# EAGLE design Clock72a (EAGLE 5.11)
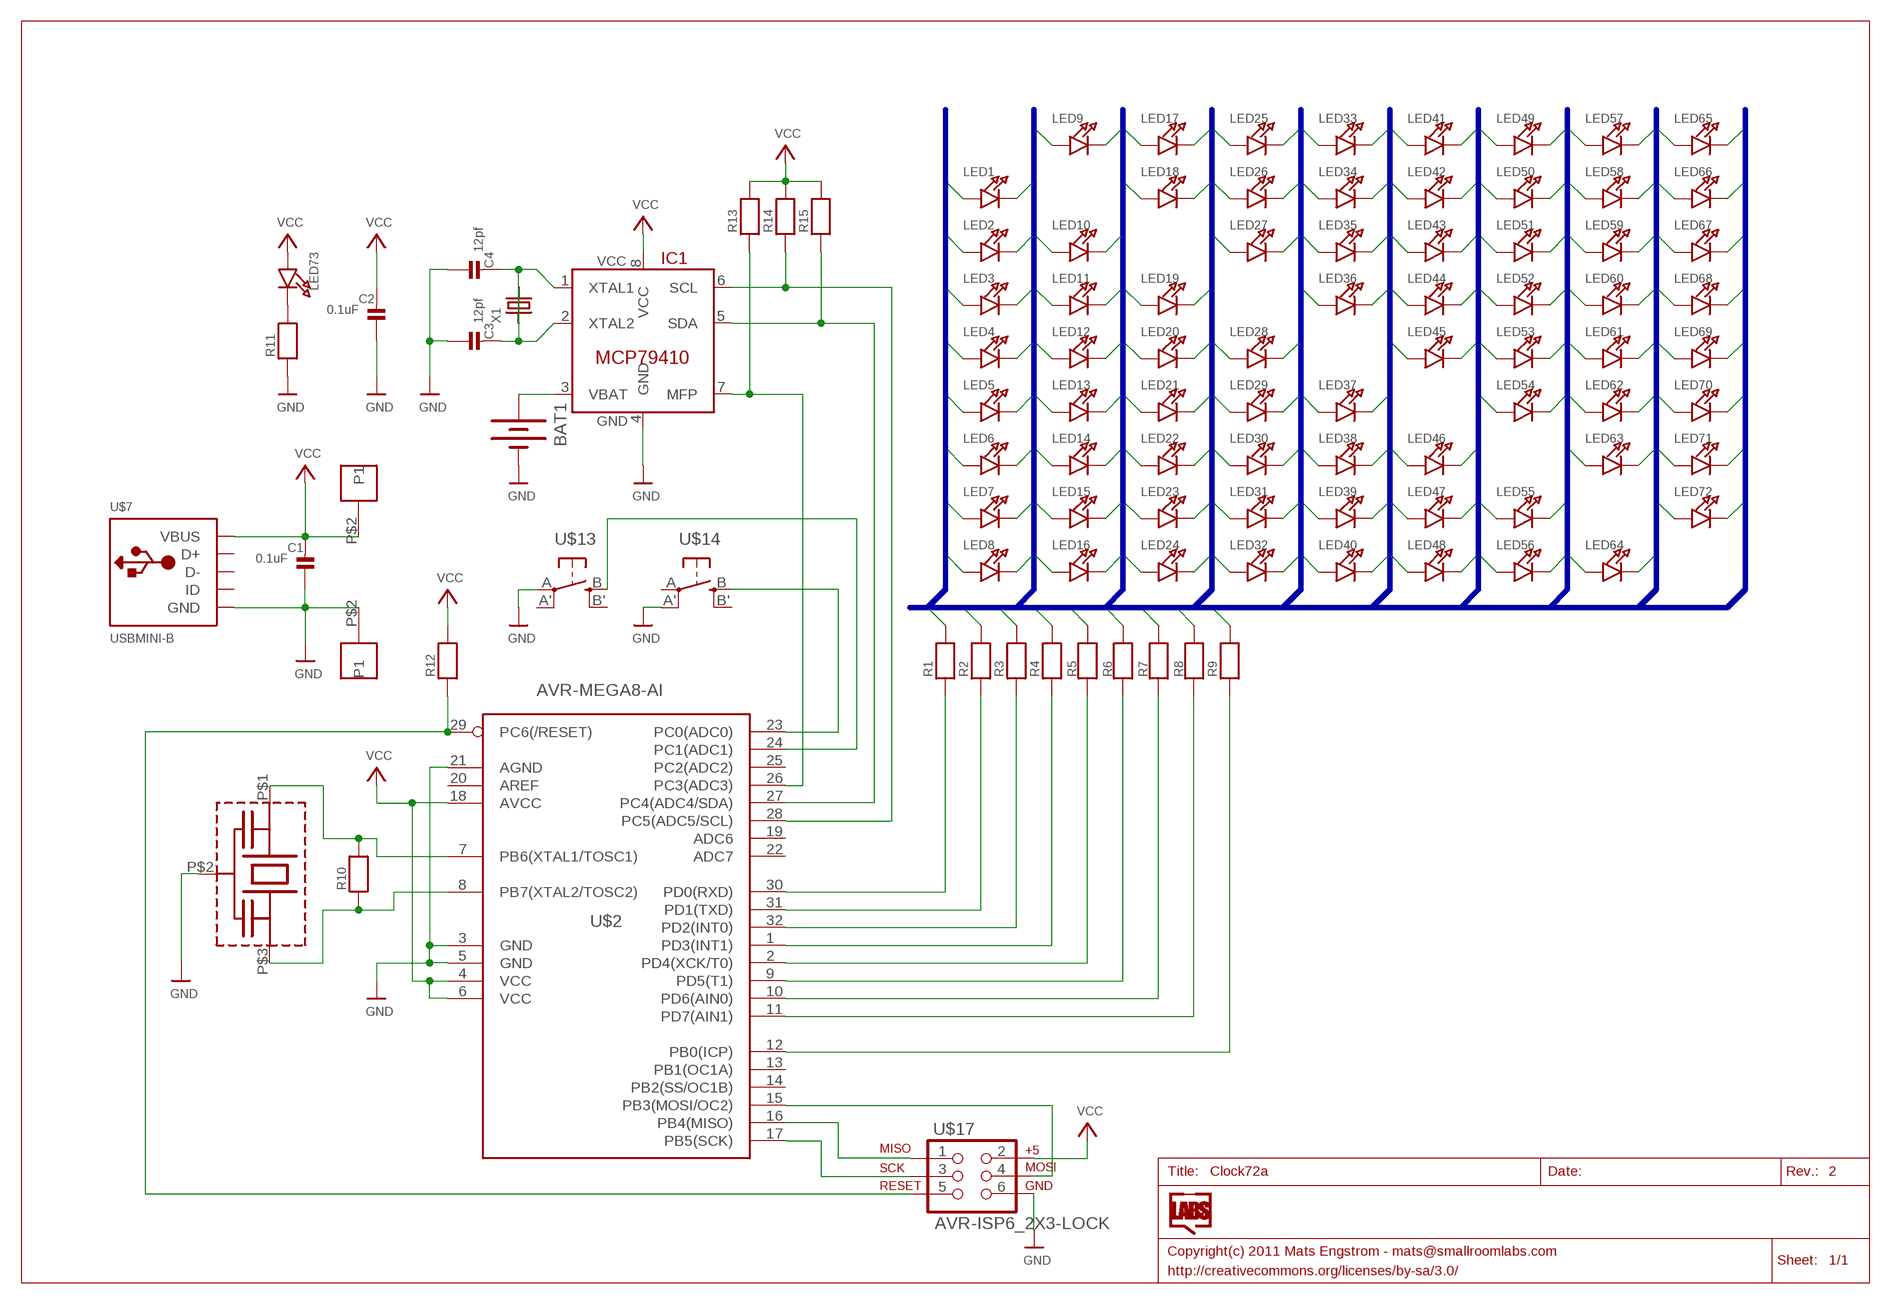
[diagram p0: schematic, sheet 1]

## Parts
BAT1  BATTERY12MM  [BATTCON_12MM]
C1  0.1uF  CAP_CERAMIC0805  [0805]
C2  0.1uF  CAP_CERAMIC0805  [0805]
C3  12pf  CAP_CERAMIC0805  [0805]
C4  12pf  CAP_CERAMIC0805  [0805]
IC1  MCP79410SOIC  MCP79410-SOIC  [SOIC8]
LED1  LEDSMD0805  [CHIPLED_0805]
LED2  LEDSMD0805  [CHIPLED_0805]
LED3  LEDSMD0805  [CHIPLED_0805]
LED4  LEDSMD0805  [CHIPLED_0805]
LED5  LEDSMD0805  [CHIPLED_0805]
LED6  LEDSMD0805  [CHIPLED_0805]
LED7  LEDSMD0805  [CHIPLED_0805]
LED8  LEDSMD0805  [CHIPLED_0805]
LED9  LEDSMD0805  [CHIPLED_0805]
LED10  LEDSMD0805  [CHIPLED_0805]
LED11  LEDSMD0805  [CHIPLED_0805]
LED12  LEDSMD0805  [CHIPLED_0805]
LED13  LEDSMD0805  [CHIPLED_0805]
LED14  LEDSMD0805  [CHIPLED_0805]
LED15  LEDSMD0805  [CHIPLED_0805]
LED16  LEDSMD0805  [CHIPLED_0805]
LED17  LEDSMD0805  [CHIPLED_0805]
LED18  LEDSMD0805  [CHIPLED_0805]
LED19  LEDSMD0805  [CHIPLED_0805]
LED20  LEDSMD0805  [CHIPLED_0805]
LED21  LEDSMD0805  [CHIPLED_0805]
LED22  LEDSMD0805  [CHIPLED_0805]
LED23  LEDSMD0805  [CHIPLED_0805]
LED24  LEDSMD0805  [CHIPLED_0805]
LED25  LEDSMD0805  [CHIPLED_0805]
LED26  LEDSMD0805  [CHIPLED_0805]
LED27  LEDSMD0805  [CHIPLED_0805]
LED28  LEDSMD0805  [CHIPLED_0805]
LED29  LEDSMD0805  [CHIPLED_0805]
LED30  LEDSMD0805  [CHIPLED_0805]
LED31  LEDSMD0805  [CHIPLED_0805]
LED32  LEDSMD0805  [CHIPLED_0805]
LED33  LEDSMD0805  [CHIPLED_0805]
LED34  LEDSMD0805  [CHIPLED_0805]
LED35  LEDSMD0805  [CHIPLED_0805]
LED36  LEDSMD0805  [CHIPLED_0805]
LED37  LEDSMD0805  [CHIPLED_0805]
LED38  LEDSMD0805  [CHIPLED_0805]
LED39  LEDSMD0805  [CHIPLED_0805]
LED40  LEDSMD0805  [CHIPLED_0805]
LED41  LEDSMD0805  [CHIPLED_0805]
LED42  LEDSMD0805  [CHIPLED_0805]
LED43  LEDSMD0805  [CHIPLED_0805]
LED44  LEDSMD0805  [CHIPLED_0805]
LED45  LEDSMD0805  [CHIPLED_0805]
LED46  LEDSMD0805  [CHIPLED_0805]
LED47  LEDSMD0805  [CHIPLED_0805]
LED48  LEDSMD0805  [CHIPLED_0805]
LED49  LEDSMD0805  [CHIPLED_0805]
LED50  LEDSMD0805  [CHIPLED_0805]
LED51  LEDSMD0805  [CHIPLED_0805]
LED52  LEDSMD0805  [CHIPLED_0805]
LED53  LEDSMD0805  [CHIPLED_0805]
LED54  LEDSMD0805  [CHIPLED_0805]
LED55  LEDSMD0805  [CHIPLED_0805]
LED56  LEDSMD0805  [CHIPLED_0805]
LED57  LEDSMD0805  [CHIPLED_0805]
LED58  LEDSMD0805  [CHIPLED_0805]
LED59  LEDSMD0805  [CHIPLED_0805]
LED60  LEDSMD0805  [CHIPLED_0805]
LED61  LEDSMD0805  [CHIPLED_0805]
LED62  LEDSMD0805  [CHIPLED_0805]
LED63  LEDSMD0805  [CHIPLED_0805]
LED64  LEDSMD0805  [CHIPLED_0805]
LED65  LEDSMD0805  [CHIPLED_0805]
LED66  LEDSMD0805  [CHIPLED_0805]
LED67  LEDSMD0805  [CHIPLED_0805]
LED68  LEDSMD0805  [CHIPLED_0805]
LED69  LEDSMD0805  [CHIPLED_0805]
LED70  LEDSMD0805  [CHIPLED_0805]
LED71  LEDSMD0805  [CHIPLED_0805]
LED72  LEDSMD0805  [CHIPLED_0805]
LED73  LEDSMD0805  [CHIPLED_0805]
R1  RESISTOR0805  [0805]
R2  RESISTOR0805  [0805]
R3  RESISTOR0805  [0805]
R4  RESISTOR0805  [0805]
R5  RESISTOR0805  [0805]
R6  RESISTOR0805  [0805]
R7  RESISTOR0805  [0805]
R8  RESISTOR0805  [0805]
R9  RESISTOR0805  [0805]
R10  RESISTOR0805  [0805]
R11  RESISTOR0805  [0805]
R12  RESISTOR0805  [0805]
R13  RESISTOR0805  [0805]
R14  RESISTOR0805  [0805]
R15  RESISTOR0805  [0805]
U$2  AVR-MEGA8-AI  [TQFP32-08]
U$7  USBMINI-B  [MOLEX67503]
U$10  PAD-2X3  [PAD2X3]
U$13  EVQQ2  [EVQ-Q2]
U$14  EVQQ2  [EVQ-Q2]
U$17  AVR-ISP6_2X3-LOCK  [2X3_LOCK]
U$21  PAD-2X3  [PAD2X3]
X1  CRYSTAL32.768  [CRYSTAL32SMT]
X2  CER-RES-3P-PBRC-H  [PBRC-H]

## Nets
CP1: LED1.C LED2.C LED3.C LED4.C LED5.C LED6.C LED7.C LED8.C LED9.A LED17.A LED25.A LED33.A LED41.A LED49.A LED57.A LED65.A R1.2
CP2: LED1.A LED9.C LED10.C LED11.C LED12.C LED13.C LED14.C LED15.C LED16.C LED18.A LED26.A LED34.A LED42.A LED50.A LED58.A LED66.A R2.2
CP3: LED2.A LED10.A LED17.C LED18.C LED19.C LED20.C LED21.C LED22.C LED23.C LED24.C LED27.A LED35.A LED43.A LED51.A LED59.A LED67.A R3.2
CP4: LED3.A LED11.A LED19.A LED25.C LED26.C LED27.C LED28.C LED29.C LED30.C LED31.C LED32.C LED36.A LED44.A LED52.A LED60.A LED68.A R4.2
CP5: LED4.A LED12.A LED20.A LED28.A LED33.C LED34.C LED35.C LED36.C LED37.C LED38.C LED39.C LED40.C LED45.A LED53.A LED61.A LED69.A R5.2
CP6: LED5.A LED13.A LED21.A LED29.A LED37.A LED41.C LED42.C LED43.C LED44.C LED45.C LED46.C LED47.C LED48.C LED54.A LED62.A LED70.A R6.2
CP7: LED6.A LED14.A LED22.A LED30.A LED38.A LED46.A LED49.C LED50.C LED51.C LED52.C LED53.C LED54.C LED55.C LED56.C LED63.A LED71.A R7.2
CP8: LED7.A LED15.A LED23.A LED31.A LED39.A LED47.A LED55.A LED57.C LED58.C LED59.C LED60.C LED61.C LED62.C LED63.C LED64.C LED72.A R8.2
CP9: LED8.A LED16.A LED24.A LED32.A LED40.A LED48.A LED56.A LED64.A LED65.C LED66.C LED67.C LED68.C LED69.C LED70.C LED71.C LED72.C R9.2
D1: R1.1 U$2.30(PD0(RXD))
D2: R2.1 U$2.31(PD1(TXD))
D3: R3.1 U$2.32(PD2(INT0))
D4: R4.1 U$2.1(PD3(INT1))
D5: R5.1 U$2.2(PD4(XCK/T0))
D6: R6.1 U$2.9(PD5(T1))
D7: R7.1 U$2.10(PD6(AIN0))
D8: R8.1 U$2.11(PD7(AIN1))
D9: R9.1 U$2.12(PB0(ICP))
GND: BAT1.GND(-) C1.1 C2.1 C3.1 C4.1 IC1.4(GND) R11.1 U$2.3(GND) U$2.5(GND) U$2.21(AGND) U$7.GND U$13.A(P) U$14.A'(P1) U$17.6(GND) U$21.P$2(P1) X2.P$2(GND)
MISO: U$2.16(PB4(MISO)) U$17.1(MISO)
MOSI: U$2.15(PB3(MOSI/OC2)) U$17.4(MOSI)
N$1: LED73.C R11.2
N$12: C4.2 IC1.1(XTAL1) X1.1
N$13: C3.2 IC1.2(XTAL2) X1.2
N$14: BAT1.PWR@1(+) IC1.3(VBAT)
N$15: IC1.5(SDA) R15.1 U$2.27(PC4(ADC4/SDA))
N$16: IC1.6(SCL) R14.1 U$2.28(PC5(ADC5/SCL))
RESET: R12.1 U$2.29(PC6(/RESET)) U$17.5(RESET)
RTCPULSE: IC1.7(MFP) R13.1 U$2.26(PC3(ADC3))
SCK: U$2.17(PB5(SCK)) U$17.3(SCK)
SW-A: U$2.23(PC0(ADC0)) U$14.B(S)
SW-B: U$2.24(PC1(ADC1)) U$13.B(S)
VCC: C1.2 C2.2 IC1.8(VCC) LED73.A R12.2 R13.2 R14.2 R15.2 U$2.4(VCC) U$2.6(VCC) U$2.18(AVCC) U$7.VBUS U$10.P$2(P1) U$17.2(V+)
XTAL1: R10.2 U$2.7(PB6(XTAL1/TOSC1)) X2.P$1(IN)
XTAL2: R10.1 U$2.8(PB7(XTAL2/TOSC2)) X2.P$3(OUT)
Unconnected: U$2.13(PB1(OC1A)) U$2.14(PB2(SS/OC1B)) U$2.19(ADC6) U$2.20(AREF) U$2.22(ADC7) U$2.25(PC2(ADC2)) U$7.D+ U$7.D- U$7.ID U$13.A'(P1) U$13.B'(S1) U$14.A(P) U$14.B'(S1)

## Buses
CP[1..9]

## Library data of the parts
BAT1 = SparkFun:BATTERY: Battery Holders Various common sizes : AA, AAA, 20mm coin cell and 12mm coin cell.
C1-C4 = microbuilder:CAP_CERAMIC: Ceramic Capacitors 0402 - 0402 Surface Mount Capacitors 0.1uF 10V 10% [Digikey: 490-1318-2-ND] 0603 - 0603 Surface Mount Capacitors 16 pF 50V 5% [Digikey: 445-5051-2-ND] 22 pF 50V [Digikey: PCC220ACVTR-ND] 33 pF 50V 5% [Digikey: 490-1415-1-ND] 56pF 50V 5% [Digikey: 490-1421-1-ND] 220pF 50V 5% [Digikey: 445-1285-1-ND] 680 pF 50V 2200 pF 50V 5% C0G [Digikey: 445-1297-1-ND] 5600 pF 100V 5% X7R [Digikey: 478-3711-1-ND] 0.1 µF 25V 10% [Digikey: PCC2277TR-ND] 0.22 µF 16V 10% X7R [Digikey: 445-1318-1-ND] 1.0 µF 25V 10% [Digikey: 445-5146-2-ND] 0603 - RF Specific 3pF 250V +/-0.1pF RF [Digikey: 712-1347-1-ND] 18 pF 250V 5% [Digikey: 478-3505-1-ND or 712-1322-1-ND] 56 pF 250V 5% C0G RF [Digikey: 490-4867-1-ND] 68 pF 250V RF [Digikey: 490-4868-1-ND] 0805 - 0805 Surface Mount Capacitors 220 pF 250V 2% RF Ceramic Capacitor [Digikey: 712-1398-1-ND] 1000 pF 50V 2% NP0 Ceramic Capacitor [Digikey: 478-3760-1-ND] 0.1 µF 25V 10% Ceramic Capacitor [Digikey: PCC1828TR-ND] 1.0 µF 16V 10% Ceramic Capacitor[Digikey: 490-1691-2-ND] 10.0 µF 10V 10% Ceramic Capacitor[Digikey: 709-1228-1-ND] 1206 - 1206 Surface Mount Capacitors
IC1 = SmallRoomLabs:MCP79410
LED1-LED73 = SmallRoomLabs:LED
R1-R15 = microbuilder:RESISTOR: Resistors 0402 - 0402 Surface Mount Package 10.0K 1% 1/16W [Digikey: 311-10.0KLRTR-ND] 0603 - 0603 Surface Mount Package 0 Ohm 1/10 Watt 1% Resistor 15 Ohm 1/10 Watt 1% Resistor 33 Ohm 1/10 Watt 1% Resistor 49.9 Ohm 1/10 Watt 1% Resistor 100 Ohm 1/10 Watt 1% Resistor 150 Ohm 1/10 Watt 1% Resistor 240 Ohm 1/10 Watt 1% Resistor 390 Ohm 1/10 Watt 1% Resistor 560 Ohm 1/10 Watt 1% Resistor 750 Ohm 1/10 Watt 1% Resistor 1.0K Ohm 1/10 Watt 1% Resistor 1.5K Ohm 1/10 Watt 1% Resistor 2.0K Ohm 1/10 Watt 1% Resistor 4.7K Ohm 1/10 Watt 1% Resistor 10.0K Ohm 1/10 Watt 1% Resistor 20.0K Ohm 1/10 Watt 1% Resistor 33.0K Ohm 1/10 Watt 1% Resistor 100.0K Ohm 1/10 Watt 1% Resistor 0805 - 0805 Surface Mount Package 0 Ohm 1/8 Watt 1% Resistor 33 Ohm 1/8 Watt 1% Resistor 100 Ohm 1/8 Watt 1% Resistor 150 Ohm 1/8 Watt 1% Resistor 200 Ohm 1/8 Watt 1% Resistor 240 Ohm 1/8 Watt 1% Resistor 330 Ohm 1/8 Watt 1% Resistor 390 Ohm 1/8 Watt 1% Resistor 470 Ohm 1/8 Watt 1% Resistor 1.0K Ohm 1/8 Watt 1% Resistor 1.5K Ohm 1/8 Watt 1% Resistor 2.0K Ohm 1/8 Watt 1% Resistor 4.7K Ohm 1/8 Watt 1% Resistor 5.1K Ohm 1/8 Watt 1% Resistor 5.6K Ohm 1/8 Watt 1% Resistor 10.0K Ohm 1/8 Watt 1% Resistor 22.0K Ohm 1/8 Watt 1% Resistor 33.0K Ohm 1/8 Watt 1% Resistor 100K Ohm 1/8 Watt 1% Resistor 1206 - 1206 Surface Mount Package
U$2 = SparkFun:AVR-MEGA8: MICROCONTROLLER 8 Kbytes FLASH 1 kbytes SRAM 512 bytes EEPROM USART 6-channel 10 bit ADC 2-channel 8 bit ADC
U$7 = SmallRoomLabs:USB
U$10 U$21 = SmallRoomLabs:PAD
U$13 U$14 = adafruit:EVQQ2: SMT 6mm switch, EVQQ2 series http://www.ladyada.net/library/eagle
U$17 = SmallRoomLabs:AVR-ISP6
X1 = microbuilder:CRYSTAL: Crystals HC49UP - Surface Mount Crystal 4.0MHz 18pF +/-30ppm Surface Mount Crystal [Digikey: 535-9857-1-ND] 12.0 MHz Surface Mount Crystal [Digikey: 535-9869-6-ND] 25.0 MHz Surface Mount Crystal [Digikey: 535-9078-1-ND] 3.2 x 2.5mm - MEMs SMT Crystal 12.0 MHz 8pF 15ppm 3.2 x 2.5mm Crystal [Digikey: 644-1047-1-ND] 16.0 MHz 8pF 15ppm 3.2 x 2.5mm Crystal [Digikey: 644-1049-1-ND] 16.0 MHz 10pF 10ppm 3.2 x 2.5mm Crystal [Digikey: 644-1100-1-ND] 27.12 MHz 18pF 30ppm 3.2 x 2.5mm Crystal [Digikey: 887-1424-1-ND] 4.9 x 1.8mm - MEMs SMT Crystal 32.768 KHz 12.5pF 20ppm 4.9 x 1.8mm Crystal [Digikey: SE2415CT-ND] Cylinder 32.768KHz Cylinder Crystal
X2 = SmallRoomLabs:CER-RES-3P

## Net classes
0 default: width 0.178 mm, drill 0.076 mm, clearance 0.178 mm

## Board
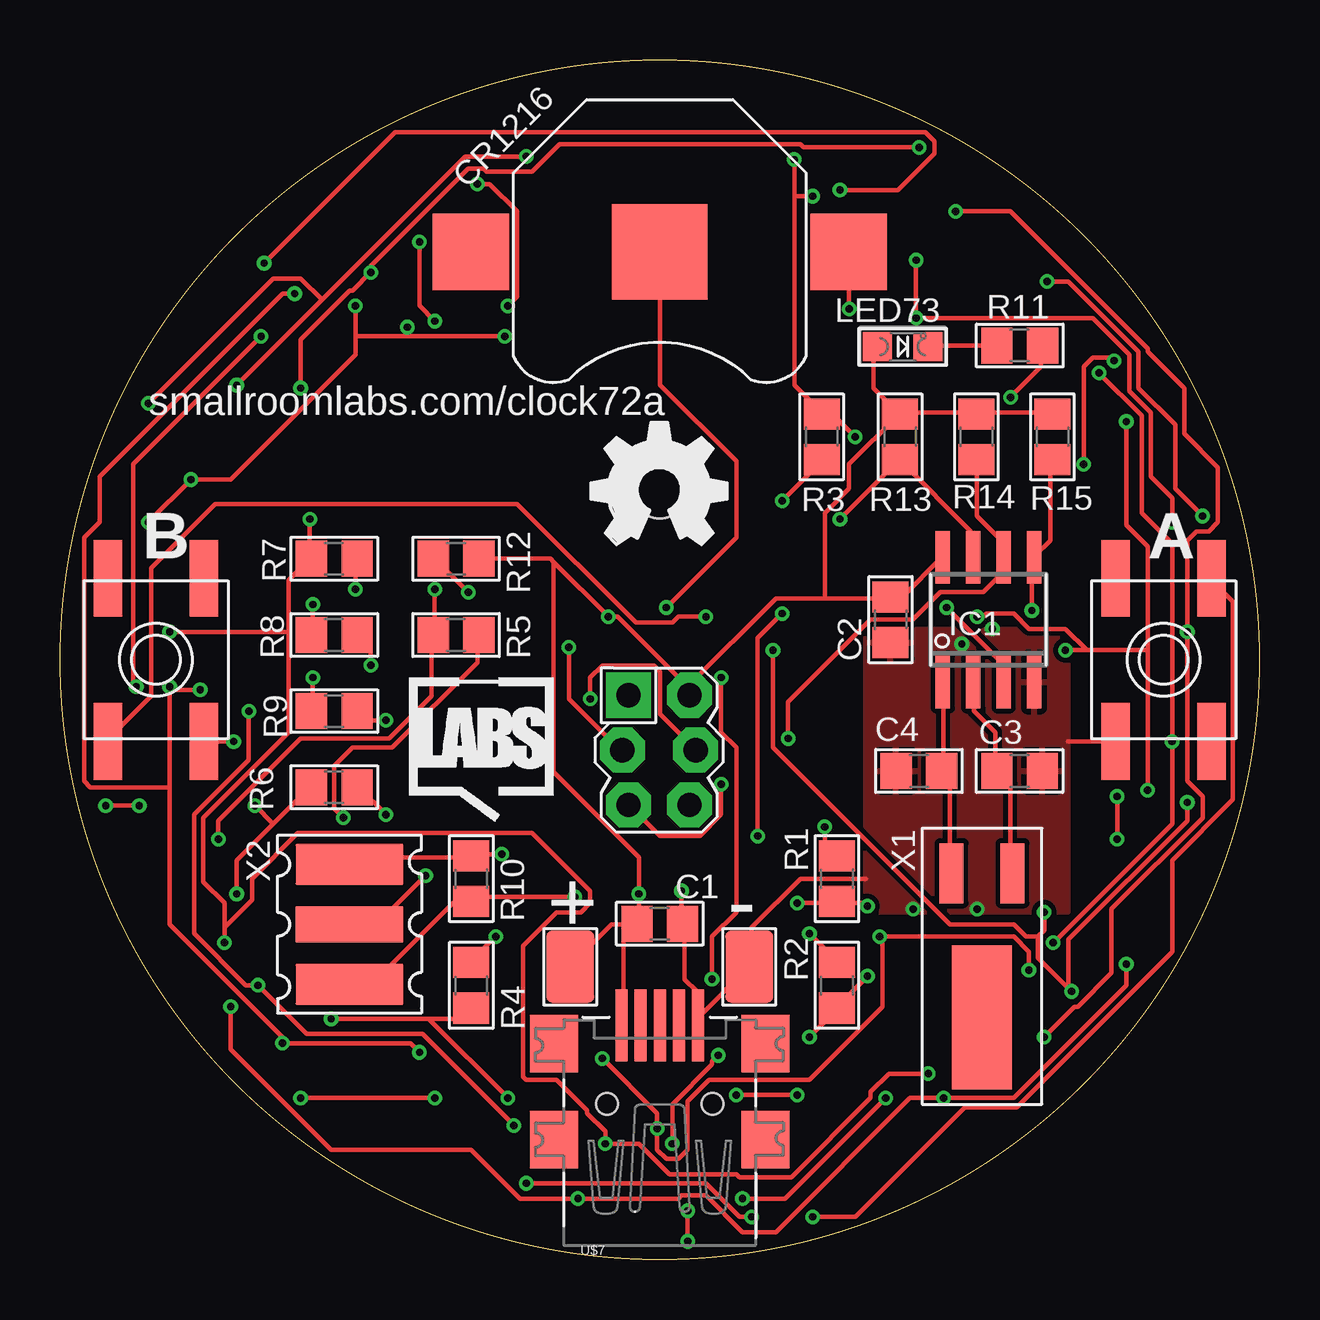
[diagram p1: board, top side]
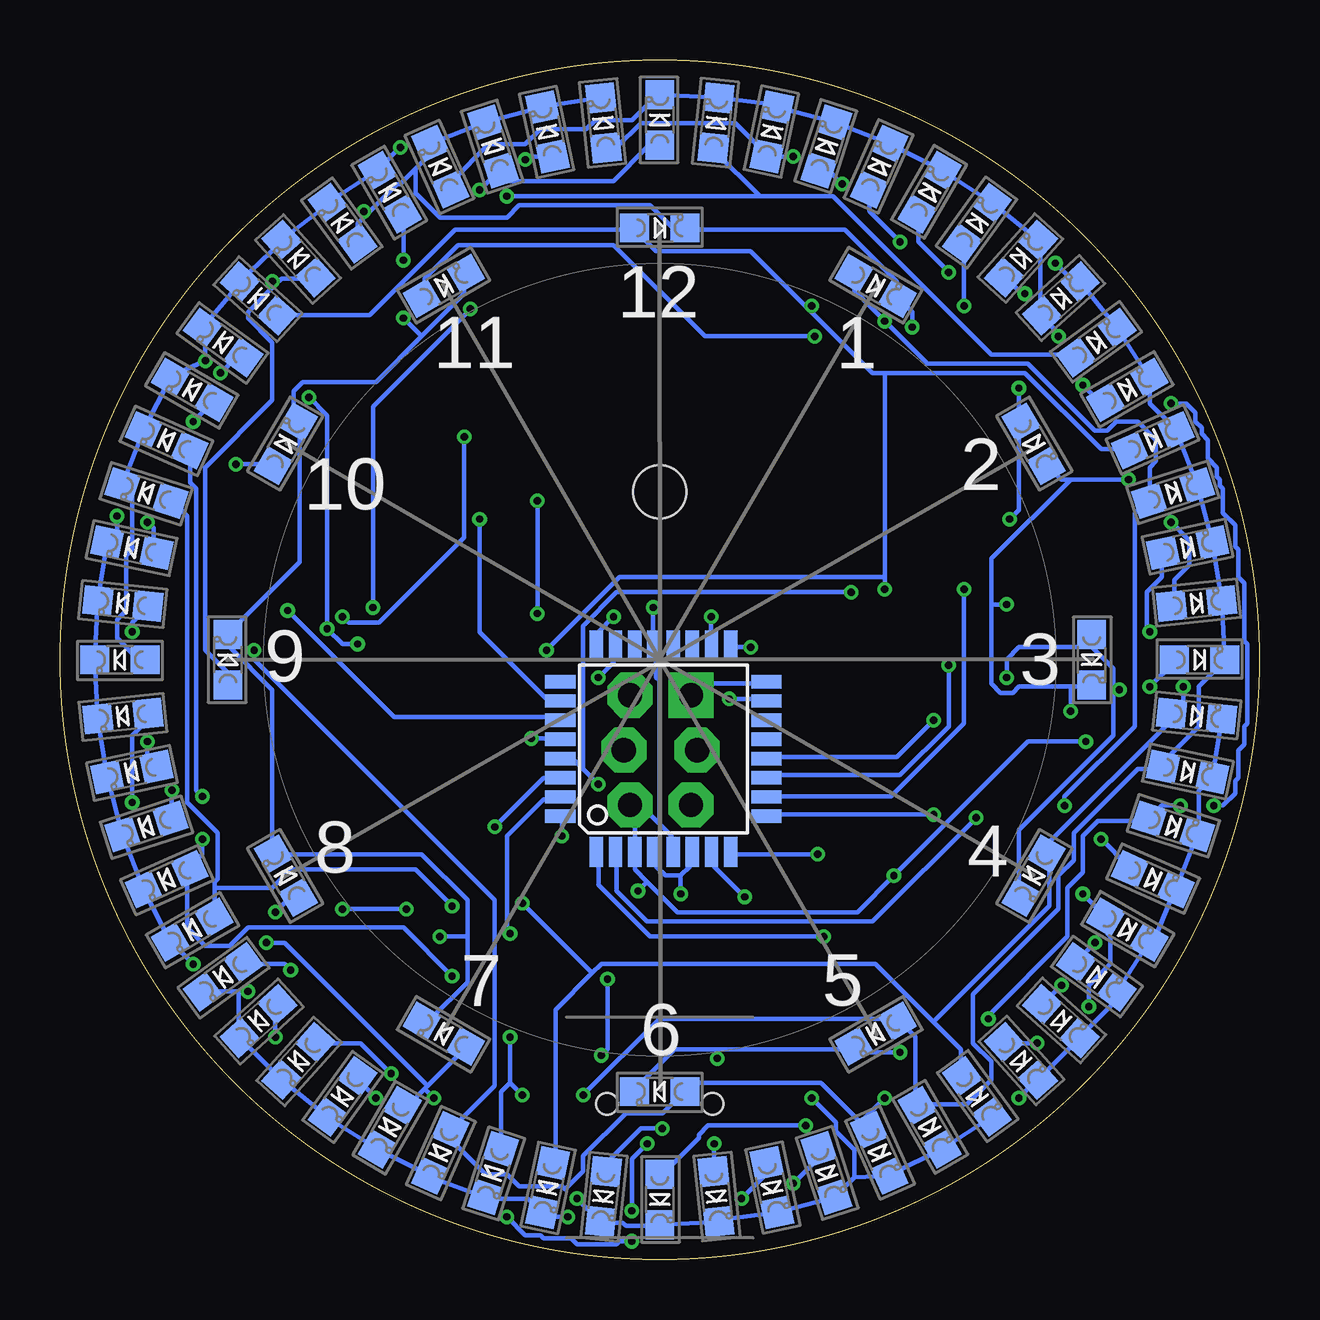
[diagram p2: board, bottom side, seen from below]

Size 50 x 50 mm. Coordinates in mm from the lower left corner, seen from the top.
Outline: circle at 25,25 radius 25
Copper layers (1*16): Top 0.035mm / dielectric 1.5mm / Bottom 0.035mm
Design rules "Fusion_eagle_rule_v1.1": minimum track width 6mil, minimum drill 12mil, track to track 6mil, track to pad 6mil, pad to pad 6mil, via to via 6mil, smd to smd 0mil, copper to edge 10mil, drill to drill 10mil, minimum pad ring 10mil, minimum via ring 6mil, stop-mask expansion 2mil, vias tented up to drill 100mil, thermal gap 10mil
Holes 2.2 mm at 25,32
tRestrict: area 22,29 to 28,35
bRestrict: area 22,29 to 28,35
vRestrict: area 19,35 to 31,48; area 65.2,33.1 to 68,35.9; area 56,17.1 to 58.9,19.9; area 65.4,12.8 to 68.2,15.7; area 61.7,10.6 to 64.5,13.4; area 72,7.1 to 74.8,10; area 75.6,31.7 to 78.4,34.5; area 63.2,26.8 to 66.1,29.6; area 61,39 to 63.8,41.8; area 64.4,40 to 67.2,42.9; area 59.6,35 to 62.5,37.8

### Footprints (pad centres in the part's own frame; a part is rotated, then mirrored left to right if it is on the bottom)
BATTCON_12MM = smd 3.962 x 3.962: GND 0,0 | smd 3.175 x 3.175: PWR@1 -7.874,0; PWR@2 7.874,0
0805 = smd 1.3 x 1.5: 1 -0.95,0; 2 0.95,0
SOIC8 = smd 0.6 x 2.2: 1 -1.905,-2.6; 2 -0.635,-2.6; 3 0.635,-2.6; 4 1.905,-2.6; 5 1.905,2.6; 6 0.635,2.6; 7 -0.635,2.6; 8 -1.905,2.6
CHIPLED_0805 = smd 1.2 x 1.2: A 0,-1.05; C 0,1.05
TQFP32-08 = smd 1.27 x 0.559: 1 -4.293,2.8; 2 -4.293,2; 3 -4.293,1.2; 4 -4.293,0.4; 5 -4.293,-0.4; 6 -4.293,-1.2; 7 -4.293,-2; 8 -4.293,-2.8; 17 4.293,-2.8; 18 4.293,-2; 19 4.293,-1.2; 20 4.293,-0.4; 21 4.293,0.4; 22 4.293,1.2; 23 4.293,2; 24 4.293,2.8 | smd 0.559 x 1.27: 9 -2.8,-4.293; 10 -2,-4.293; 11 -1.2,-4.293; 12 -0.4,-4.293; 13 0.4,-4.293; 14 1.2,-4.293; 15 2,-4.293; 16 2.8,-4.293; 25 2.8,4.293; 26 2,4.293; 27 1.2,4.293; 28 0.4,4.293; 29 -0.4,4.293; 30 -1.2,4.293; 31 -2,4.293; 32 -2.8,4.293
MOLEX67503 = smd 0.5 x 3: D+ 0,3.264; D- -0.8,3.264; GND 1.6,3.264; ID 0.8,3.264; VBUS -1.6,3.264 | smd 2 x 2.4: GND1 -4.4,-1.5; GND2 -4.4,2.5; GND3 4.4,2.5; GND4 4.4,-1.5 | hole 0.9: -2.2,0; 2.2,0
PAD2X3 = smd 2 x 3: P$2 0,0
EVQ-Q2 = smd 3.2 x 1.2: A -3.4,-2; A' 3.4,-2; B -3.4,2; B' 3.4,2
2X3_LOCK = drill 1.016 pad 1.88 square: 1 -2.286,-1.27 | drill 1.016 pad 1.88 octagon: 2 -2.286,1.27; 3 0,-1.524; 4 0,1.524; 5 2.286,-1.27; 6 2.286,1.27
CRYSTAL32SMT = smd 2.5 x 1: 1 2.125,1.27; 2 2.125,-1.27 | smd 6 x 2.5: CYLINDER -3.875,0
PBRC-H = smd 1.7 x 4.5: P$1 -2.5,0; P$3 2.5,0 | smd 1.5 x 4.5: P$2 0,0

### Placement (x,y rotation side)
BAT1  25,42 180 top
C1  25,14 180 top
C2  34.62,26.67 90 top
C3  40,20.36 180 top
C4  35.8,20.36 0 top
IC1  38.7,26.67 0 top
LED1  25,47.5 0 bottom
LED2  22.65,47.38 354 bottom
LED3  20.32,47.01 348 bottom
LED4  18.05,46.4 342 bottom
LED5  15.85,45.55 336 bottom
LED6  13.75,44.49 330 bottom
LED7  11.78,43.2 324 bottom
LED8  9.95,41.72 318 bottom
LED9  8.28,40.05 312 bottom
LED10  6.8,38.23 306 bottom
LED11  5.51,36.25 300 bottom
LED12  4.45,34.15 294 bottom
LED13  3.6,31.95 288 bottom
LED14  2.99,29.68 282 bottom
LED15  2.62,27.35 276 bottom
LED16  2.5,25 270 bottom
LED17  2.62,22.65 264 bottom
LED18  2.99,20.32 258 bottom
LED19  3.6,18.05 252 bottom
LED20  4.45,15.85 246 bottom
LED21  5.51,13.75 240 bottom
LED22  6.8,11.78 234 bottom
LED23  8.28,9.95 228 bottom
LED24  9.95,8.28 222 bottom
LED25  11.78,6.8 216 bottom
LED26  13.75,5.51 210 bottom
LED27  15.85,4.45 204 bottom
LED28  18.05,3.6 198 bottom
LED29  20.32,2.99 192 bottom
LED30  22.65,2.62 186 bottom
LED31  25,2.5 180 bottom
LED32  27.35,2.62 174 bottom
LED33  29.68,2.99 168 bottom
LED34  31.95,3.6 162 bottom
LED35  34.15,4.45 156 bottom
LED36  36.25,5.51 150 bottom
LED37  38.23,6.8 144 bottom
LED38  40.05,8.28 138 bottom
LED39  41.72,9.95 132 bottom
LED40  43.2,11.78 126 bottom
LED41  44.49,13.75 120 bottom
LED42  45.55,15.85 114 bottom
LED43  46.4,18.05 108 bottom
LED44  47.01,20.32 102 bottom
LED45  47.38,22.65 96 bottom
LED46  47.5,25 90 bottom
LED47  47.38,27.35 84 bottom
LED48  47.01,29.68 78 bottom
LED49  46.4,31.95 72 bottom
LED50  45.55,34.15 66 bottom
LED51  44.49,36.25 60 bottom
LED52  43.2,38.23 54 bottom
LED53  41.72,40.05 48 bottom
LED54  40.05,41.72 42 bottom
LED55  38.23,43.2 36 bottom
LED56  36.25,44.49 30 bottom
LED57  34.15,45.55 24 bottom
LED58  31.95,46.4 18 bottom
LED59  29.68,47.01 12 bottom
LED60  27.35,47.38 6 bottom
LED61  25,43 270 bottom
LED62  16,40.59 240 bottom
LED63  9.41,34 210 bottom
LED64  7,25 180 bottom
LED65  9.41,16 150 bottom
LED66  16,9.41 120 bottom
LED67  25,7 90 bottom
LED68  34,9.41 60 bottom
LED69  40.59,16 30 bottom
LED70  43,25 0 bottom
LED71  40.59,34 330 bottom
LED72  34,40.59 300 bottom
LED73  35.13,38.05 270 top
R1  32.38,15.88 270 top
R2  32.38,11.43 270 top
R3  31.75,34.29 90 top
R4  17.14,11.43 270 top
R5  16.51,26.04 180 top
R6  11.43,19.68 180 top
R7  11.43,29.21 180 top
R8  11.43,26.04 180 top
R9  11.43,22.86 180 top
R10  17.14,15.88 270 top
R11  40.01,38.1 180 top
R12  16.51,29.21 0 top
R13  35.02,34.29 90 top
R14  38.2,34.29 90 top
R15  41.37,34.29 90 top
U$2  24.84,21.28 90 bottom
U$7  25,6.5 0 top
U$10  21.27,12.2 0 top
U$13  4,25 90 top
U$14  46,25 270 top
U$17  24.97,21.23 270 top
U$19  [OSHW_FILLX200_NOTEXT]  22.14,29.8 0 top
U$20  [SRL-LOGO-SILK-5MM]  14.52,19.32 0 top
U$21  28.73,12.2 0 top
X1  38.43,13.97 90 top
X2  12.06,13.97 90 top

### Tracks (layer width: path | path; a pad name or v marks a point on that pad's centre or on a via)
CP1  (via drill 0.3)
  Top 0.178: v30.73,14.86 32.38,14.86 | 32.38,14.86 R1.2 32.38,14.86 | v33.66,14.73 33.53,14.86 32.38,14.86 | v8.38,38.48 3.05,33.15 3.05,24 v3.17,23.88
  Bottom 0.178: LED57.A 33.66,44.7 33.66,44.96 32.13,46.48 30.61,46.48 29.97,47.12 28.07,47.12 27.69,47.5 26.16,47.5 25.02,48.64 LED1.C LED2.C | LED2.C 22.48,48.39 | 43.56,15.49 43.56,15.75 43.43,15.88 43.43,17.78 44.7,19.05 44.7,30.99 45.34,31.62 LED49.A | 43.56,15.49 43.56,14.35 LED41.A | 27.81,11.94 27.43,12.32 16,12.32 13.59,9.91 | 27.81,11.94 29.34,10.41 29.34,4.06 LED33.A | 13.59,9.91 12.45,8.76 12.45,7.75 LED25.A | 13.59,9.91 8.76,14.73 8.76,16.89 LED65.A 8.76,17.02 8.76,17.4 3.68,22.48 3.68,22.73 LED17.A 3.56,22.86 3.17,23.24 v3.17,23.88 | 27.81,11.94 v30.73,14.86 | 43.56,15.49 41.15,15.49 40.39,16.26 35.18,16.26 v33.66,14.73 | v8.38,38.48 8.38,38.61 9.02,39.24 LED9.A 9.14,39.37 9.14,42.42 LED8.C LED7.C LED6.C LED5.C LED4.C LED3.C 20.19,48.13 LED2.C
CP2  (via drill 0.3)
  Top 0.178: v31.24,9.27 32.38,10.41 R2.2 32.38,10.54 v33.66,11.81 | v44.07,17.53 v44.07,19.3 | v32.51,44.58 34.92,44.58 36.45,46.1 36.45,46.61 36.07,46.99 13.97,46.99 v8.51,41.53 | v28.19,6.86 v30.73,6.86
  Bottom 0.178: 31.24,7.37 31.62,6.99 31.62,4.7 LED34.A | 31.24,7.37 v31.24,9.27 | v33.66,11.81 35.69,13.84 42.16,13.84 42.93,13.08 43.94,13.08 44.7,13.84 44.7,16.26 LED42.A 44.58,16.38 44.07,16.89 v44.07,17.53 | v44.07,19.3 44.32,19.56 44.32,32.13 44.58,32.38 44.58,33.66 LED50.A | LED1.A 25.02,46.35 25.53,46.35 26.92,44.96 31.24,44.96 31.62,45.34 LED58.A 31.75,45.34 v32.51,44.58 | v8.51,41.53 7.62,40.64 LED9.C LED10.C LED11.C 4.57,36.7 4.57,35.69 3.56,34.67 LED12.C LED13.C LED14.C LED15.C LED16.C 1.52,24.89 2.54,23.88 2.54,22.23 3.94,20.83 3.94,20.57 LED18.A 4.06,20.45 5.08,20.45 7.75,17.78 7.75,16.64 8.38,16 8.38,14.61 11.94,11.05 11.94,9.02 11.18,8.26 11.18,7.49 12.19,6.48 14.22,6.48 LED26.A 14.35,6.48 14.35,9.27 14.99,9.91 LED66.A 15.11,10.03 25.02,10.03 v28.19,6.86 | v30.73,6.86 31.24,7.37
CP3  (via drill 0.3)
  Top 0.178: 30.61,44.32 30.61,36.45 31.75,35.31 R3.2 31.75,35.18 32.26,35.18 v33.15,34.29 | 30.61,44.32 v30.61,45.85 | 30.61,44.32 v31.37,44.32 | v44.45,34.92 44.45,30.61 45.34,29.72 45.34,25.4 | 45.34,25.4 v45.34,19.56 | v41.91,25.4 42.8,25.4 | 42.8,25.4 45.34,25.4 | v10.03,6.73 v15.62,6.73 | v38.23,26.8 38.48,26.8 38.61,26.92 39.75,26.92 40.39,26.29 41.91,26.29 42.8,25.4
  Bottom 0.178: v30.61,45.85 30.48,45.97 LED59.A | 20.83,44.32 17.78,44.32 11.18,37.72 7.75,37.72 LED10.A | 20.83,44.32 22.73,46.23 LED2.A | v31.37,44.32 20.83,44.32 | v44.45,34.92 43.69,35.69 LED51.A | v45.34,19.56 45.34,18.41 LED43.A | 16.64,5.71 18.29,7.37 23.62,7.37 23.88,7.11 LED67.A 24,6.99 24.89,6.1 26.42,6.1 28.19,4.32 28.19,3.68 28.96,2.92 29.08,3.05 30.86,3.05 31.37,3.56 32.26,3.56 33.66,4.95 33.66,5.33 LED35.A 33.66,5.46 31.88,7.24 31.88,14.99 41.91,25.02 v41.91,25.4 | 16.64,5.71 16.38,5.46 LED27.A 16.64,5.71 | v10.03,6.73 9.27,7.49 LED24.C LED23.C 7.49,9.27 5.97,10.79 5.97,11.05 LED22.C LED21.C 4.65,12.68 3.56,15.37 LED20.C LED19.C 2.54,17.78 2.54,19.56 2.03,20.07 LED18.C LED17.C | v15.62,6.73 16.64,5.71 | v33.15,34.29 33.15,30.1 36.7,26.54 37.97,26.54 v38.23,26.8
CP4  (via drill 0.3)
  Top 0.178: v43.31,36.96 45.09,35.18 45.09,31.11 46.35,29.84 v46.35,21.59 46.35,18.16 v41.4,13.21 | 10.92,40.01 16.89,45.97 v19.43,45.97 | 10.92,40.01 v7.37,36.45 | 15.37,10.03 16.76,10.03 17.14,10.41 R4.2 | 15.37,10.03 v11.3,10.03 | v18.67,6.73 15.37,10.03 | 10.92,40.01 10.03,40.89 8.89,40.89 v3.68,35.69 | v3.3,18.92 v1.91,18.92 | v34.42,6.73 30.23,2.54 v28.45,2.54
  Bottom 0.178: 34.67,7.24 33.15,8.76 LED68.A | 34.8,7.11 34.67,7.24 | 34.8,7.11 35.43,6.48 35.69,6.48 LED36.A | v43.31,36.96 42.67,37.59 42.42,37.59 LED52.A | v46.35,21.59 46.35,20.83 46.1,20.57 LED44.A | 34.67,7.24 40.64,13.21 v41.4,13.21 | v7.37,36.45 6.73,35.81 6.48,35.81 LED11.A | v19.43,45.97 20.45,45.97 LED3.A 20.57,46.1 21.84,47.37 25.78,47.37 26.8,46.35 27.18,46.35 LED60.A | LED29.C 20.19,1.91 | LED27.C 15.49,3.43 | LED26.C 13.34,4.57 | LED27.C 15.37,3.56 LED26.C | 11.18,5.84 LED25.C LED26.C | v11.3,10.03 11.3,10.16 8,13.46 8,15.49 7.37,16.13 7.37,17.65 6.73,18.29 4.7,18.29 LED19.A 4.57,18.41 4.06,18.92 v3.3,18.92 | 16.89,3.43 16.89,4.57 17.65,5.33 17.65,5.71 v18.67,6.73 | v3.68,35.69 3.05,35.69 2.67,35.31 2.67,34.92 2.41,34.67 2.41,34.42 2.16,34.16 2.16,33.4 1.78,33.02 1.78,32.64 1.65,32.51 1.65,32.26 1.52,32.13 1.52,31.11 1.02,30.61 1.02,29.72 0.89,29.59 0.89,28.45 0.64,28.19 0.64,25.78 0.51,25.65 0.51,22.35 0.64,22.23 0.64,21.46 0.89,21.21 0.89,20.07 1.02,19.94 1.02,19.43 1.52,18.92 v1.91,18.92 | v34.42,6.73 34.8,7.11 | v28.45,2.54 27.56,1.65 LED32.C 27.43,1.52 26.54,1.52 26.42,1.4 25.02,1.4 LED31.C LED30.C 22.48,1.65 LED29.C | LED29.C LED28.C 17.65,2.67 16.89,3.43 | LED27.C 16.89,3.43
CP5  (via drill 0.3)
  Top 0.178: v41.02,14.48 41.02,13.72 40.77,13.46 | 40.77,13.46 40.77,12.57 42.04,11.3 | 42.04,11.3 v42.16,11.18 42.04,11.3 | v46.99,19.05 46.99,18.29 42.04,13.34 42.04,11.3 | v19.43,3.17 26.92,3.17 28.32,1.78 v28.83,1.78 | v6.6,17.53 6.6,18.29 10.03,21.72 13.72,21.72 15.49,23.5 15.49,26.04 R5.2 15.62,26.04 v15.62,27.94 | v17.4,44.83 17.91,44.83 19.05,43.69 19.05,40.13 v18.67,39.75 | 40.77,13.46 40.26,13.46 39.75,13.97 37.08,13.97 29.72,21.34 v29.72,25.4
  Bottom 0.178: v41.02,14.48 40.51,14.99 40.13,14.99 LED69.A | 42.55,11.18 43.94,11.18 LED40.C | 42.55,11.18 v42.16,11.18 | v46.99,19.05 46.99,21.84 46.35,22.48 46.35,22.73 LED45.A | 42.55,11.18 42.55,9.27 LED39.C LED38.C LED37.C 38.73,5.84 LED36.C | LED36.C 36.83,4.7 | v19.43,3.17 18.41,4.19 18.41,4.57 LED28.A | v28.83,1.78 29.72,1.78 29.84,1.91 LED33.C 29.97,2.03 30.48,2.54 32.26,2.54 LED34.C | LED34.C 32.38,2.67 | v6.6,17.53 5.46,16.38 LED20.A | 15.62,36.96 16.13,36.96 18.8,39.62 | 15.62,36.96 9.78,36.96 6.6,33.78 5.46,33.78 LED12.A | 18.8,39.62 21.21,42.04 25.15,42.04 26.04,42.93 LED61.A 26.16,42.93 33.53,42.93 37.08,39.37 40.89,39.37 LED53.A | v17.4,44.83 17.91,45.34 18.29,45.34 LED4.A | 18.8,39.62 v18.67,39.75 | 15.62,28.45 15.62,36.96 | 15.62,28.45 v15.62,27.94 | v29.72,25.4 26.67,28.45 15.62,28.45 | LED36.C LED35.C 34.54,3.43 LED34.C
CP6  (via drill 0.3)
  Top 0.178: v7.37,15.24 7.37,16.64 8.89,18.16 | 8.89,18.16 10.41,19.68 R6.2 | v14.99,42.42 14.99,39.75 v15.62,39.12 | 8.89,18.16 v8.13,18.92 | v44.45,12.32 44.45,11.43 39.75,6.73 v36.83,6.73 35.43,6.73 29.84,1.14 28.45,1.14 26.92,2.67 25.91,2.67 25.78,2.54 v21.59,2.54 19.18,2.54 17.14,4.57 11.3,4.57 7.11,8.76 v7.11,10.54 | v41.15,40.77 42.04,40.77 44.96,37.85 44.96,36.32 46.48,34.8 46.48,32.13 v47.62,30.99
  Bottom 0.178: v7.37,15.24 6.48,14.35 LED21.A 6.35,14.22 6.35,13.59 6.22,13.46 6.22,12.32 7.11,11.43 v7.11,10.54 | LED62.A 16.89,41.02 16.89,40.39 v15.62,39.12 13.84,37.34 9.65,37.34 6.86,34.54 6.35,34.54 5.97,34.92 5.08,34.92 4.32,34.16 4.32,33.27 4.57,33.02 4.57,31.75 LED13.A 4.7,31.62 5.21,31.11 5.21,22.23 8.13,19.3 v8.13,18.92 | v14.99,42.42 16.26,43.69 16.26,44.58 LED5.A | 41.02,40.64 40.77,40.89 39.37,40.89 LED54.A | 41.02,40.64 42.16,39.5 42.16,39.24 41.15,38.23 41.15,35.81 43.94,33.02 43.94,25.4 43.05,24.51 43.05,24 LED70.A | LED41.C 45.47,13.34 | LED45.C 48.51,22.61 | LED43.C 47.5,17.78 | v21.59,2.54 20.57,3.56 20.57,3.94 LED29.A | v36.83,6.73 37.72,7.62 LED37.A | v44.45,12.32 45.34,13.21 LED41.C | v41.15,40.77 41.02,40.64 | v47.62,30.99 47.62,30.35 48.01,29.97 LED48.C LED47.C LED46.C LED45.C | LED45.C LED44.C 48.01,20.07 LED43.C | LED43.C LED42.C 46.48,15.37 LED41.C
CP7  (via drill 0.3)
  Top 0.178: v42.67,33.15 42.67,37.21 43.05,37.59 43.81,37.59 v43.94,37.47 | v36.2,7.75 34.54,7.75 33.78,6.99 33.78,6.73 30.48,3.43 28.32,3.43 28.19,3.56 25.4,3.56 24.13,4.83 v22.73,4.83 22.73,5.33 21.97,6.1 21.97,6.22 20.7,7.49 19.43,7.49 19.3,7.62 19.3,13.08 20.7,14.48 21.72,14.48 22.1,14.86 22.1,15.37 19.68,17.78 9.91,17.78 8,15.88 8,14.99 6.86,13.84 | 6.86,13.84 6.86,14.86 5.97,15.75 5.97,18.41 9.53,21.97 9.53,26.16 | v6.86,13.21 6.86,13.84 | 9.53,26.16 9.53,28.32 10.41,29.21 | 10.41,29.21 R7.2 10.41,29.21 | 9.53,26.16 v4.57,26.16 | 10.41,29.21 v10.41,30.86 | v10.03,36.32 10.03,38.35 12.06,40.39 12.19,40.39 v12.95,41.15 12.95,41.4 17.02,45.47 17.65,45.47 17.78,45.34 19.68,45.34 20.83,46.48 30.86,46.48 30.99,46.35 v35.81,46.35
  Bottom 0.178: LED46.A 46.48,25.02 46.74,25.02 47.62,25.91 47.62,26.67 47.24,27.05 47.24,29.34 46.99,29.59 46.99,31.88 47.37,32.26 LED49.C 47.37,32.38 LED50.C | LED50.C 46.61,34.54 | v42.67,33.15 41.15,33.15 LED71.A | 43.94,38.23 43.94,38.73 LED52.C | 43.94,38.23 v43.94,37.47 45.34,36.83 LED51.C LED50.C | LED52.C 43.94,38.23 | LED54.C 40.77,42.42 LED53.C 42.55,40.64 LED52.C | LED54.C 40.64,42.55 | LED52.C 43.94,38.86 | v22.73,4.83 22.73,3.68 LED30.A | v36.2,7.75 37.47,9.02 39.24,9.02 LED38.A | v6.86,13.21 7.62,12.45 LED22.A | v4.57,26.16 4.7,26.29 4.7,27.81 4.06,28.45 4.06,29.34 LED14.A | v10.41,30.86 10.03,31.24 10.03,34.8 LED63.A 10.03,34.92 v10.03,36.32 | v12.95,41.15 14.22,42.42 14.22,43.56 LED6.A | v35.81,46.35 36.7,45.47 LED56.C LED55.C 38.86,43.94 LED54.C
CP8  (via drill 0.3)
  Top 0.178: v3.68,30.73 v5.46,32.51 7.11,32.51 12.32,37.72 12.32,38.48 | v7.87,22.86 7.87,20.83 5.59,18.54 5.59,13.59 7.75,11.43 v8.26,11.43 10.29,9.4 15.11,9.4 v18.92,5.59 | 12.32,38.48 v12.32,39.75 | 12.32,38.48 14.48,38.48 | 14.48,38.48 v18.54,38.48 | v10.54,27.3 10.54,26.04 R8.2 | v41.02,9.27 42.29,10.54 42.42,10.54 43.81,11.94 43.81,14.61 47.62,18.41 47.62,19.3 46.99,19.94 v46.99,26.16 46.99,29.97 47.37,30.35 47.88,30.35 48.26,30.73 48.26,33.02 46.86,34.42 46.86,36.32 45.34,37.85 45.34,37.97 39.62,43.69 v37.34,43.69 | 14.48,38.48 v14.48,38.86
  Bottom 0.178: v3.68,30.73 2.92,29.97 2.92,28.96 3.56,28.32 3.56,27.3 LED15.A | 7.87,32.51 8.26,32.51 8.76,33.02 LED63.C | 7.87,32.51 v5.46,32.51 | 7.87,23.88 10.03,23.88 10.29,23.62 10.79,23.62 11.18,24 11.18,27.3 | 7.87,23.88 7.11,23.88 LED64.C | 11.18,27.3 11.18,29.21 7.87,32.51 | v8.26,11.43 9.02,10.67 LED23.A | v7.87,22.86 7.87,23.88 | v12.32,39.75 12.32,42.29 LED7.A | v18.92,5.59 22.99,5.59 23.37,5.21 23.37,5.08 24.89,3.56 LED31.A | v18.54,38.48 23.11,38.48 26.92,42.29 33.4,42.29 34.8,40.89 34.8,40.13 LED72.A | 11.18,27.3 v10.54,27.3 | v41.02,9.27 41.02,10.54 LED39.A | v46.99,26.16 46.99,26.54 46.35,27.18 LED47.A | 34.04,46.61 34.54,46.61 LED57.C | 37.21,43.56 35.94,44.83 35.81,44.83 35.18,45.47 | 37.21,43.56 37.59,43.18 37.59,42.42 LED55.A | 35.18,45.47 34.04,46.61 | 34.04,46.61 LED57.C | 35.18,45.47 35.18,44.45 34.16,43.43 31.37,43.43 30.86,43.94 25.4,43.94 24.51,43.05 24,43.05 LED61.C 23.88,42.93 17.27,42.93 15.11,40.77 15.11,40.13 LED62.C 14.99,40.01 14.48,39.5 v14.48,38.86 | 37.21,43.56 v37.34,43.69 | LED60.C 30.2,48.01 LED59.C LED58.C 32.38,47.37 LED57.C
CP9  (via drill 0.3)
  Top 0.178: v40.39,12.06 40.39,12.83 39.75,13.46 34.29,13.46 | 34.29,13.46 v34.16,13.46 34.29,13.46 | v35.69,41.66 v35.69,39.24 43.05,39.24 44.58,37.72 44.58,36.2 45.47,35.31 45.47,32.64 46.35,31.75 v46.35,30.73 | v10.54,24.26 10.54,22.86 R9.2 | v22.61,8.38 24.89,6.1 v24.89,5.46 24.89,4.57 25.27,4.19 25.78,4.19 26.16,4.57 26.16,6.6 27.05,7.49 31.24,7.49 34.29,10.54 34.29,13.46 | 9.53,9.02 14.61,9.02 v14.99,8.64 | 9.53,9.02 v9.27,9.02 9.53,9.02 | 4.57,19.68 4.57,13.97 9.53,9.02 | 4.57,19.68 4.57,23.75 | 4.57,23.75 v4.57,23.88 4.57,23.75 | v9.78,40.26 9.27,40.26 1.65,32.64 1.65,30.73 1.02,30.1 1.02,19.94 1.27,19.68 4.57,19.68 | 4.57,23.75 v5.84,23.75
  Bottom 0.178: 33.02,13.46 33.02,14.99 34.92,16.89 41.02,16.89 LED69.C 41.15,17.02 41.15,23.75 42.93,25.53 42.93,26.04 LED70.C 42.93,26.16 40.01,29.08 40.01,34.8 LED71.C 40.13,34.92 40.26,35.05 40.26,36.2 39.88,36.58 36.83,36.58 34.92,38.48 | 33.02,13.46 33.02,11.56 34.54,10.03 34.8,10.03 LED68.C | v40.39,12.06 40.64,12.32 42.29,12.32 LED40.A | v34.16,13.46 33.02,13.46 | 34.92,38.48 33.15,40.26 33.15,41.02 LED72.C | v35.69,41.66 35.69,43.56 LED56.A | 34.92,38.48 v35.69,39.24 | v46.35,30.73 46.1,30.48 46.1,29.46 LED48.A | 6.99,25.53 6.99,26.04 LED64.A 6.99,25.53 | 6.99,25.53 6.1,24.64 6.1,23.75 | 6.1,23.75 6.1,21.84 10.03,17.91 10.03,15.11 LED65.C | v10.54,24.26 10.54,25.02 10.03,25.53 6.99,25.53 | 22.61,8.76 24.38,8.76 26.04,7.11 LED67.C | 22.61,8.76 17.02,8.76 LED66.C 16.89,8.76 16.76,8.64 v14.99,8.64 | v24.89,5.46 25.78,5.46 27.18,4.06 27.18,3.68 LED32.A | 22.61,8.76 v22.61,8.38 | v9.27,9.02 10.54,9.02 LED24.A | v4.57,23.88 3.56,24.89 LED16.A | v9.78,40.26 9.91,40.26 10.54,40.89 LED8.A | v5.84,23.75 6.1,23.75
D1  (via drill 0.3)
  Top 0.178: v31.88,18.03 31.88,17.4 32.38,16.89 R1.1
  Bottom 0.178: v31.88,18.03 29.84,20.07 29.21,20.07 U$2.30
D2  (via drill 0.3)
  Top 0.178: v31.24,13.59 32.38,12.45 R2.1
  Bottom 0.178: v31.24,13.59 31.37,13.72 31.37,17.65 29.84,19.18 29.21,19.18 U$2.31
D3  (via drill 0.3)
  Top 0.178: v29.08,17.65 29.08,25.91 v30.1,26.92 | v30.1,31.62 31.75,33.27 R3.1
  Bottom 0.178: v29.08,17.65 29.08,18.41 U$2.32 | v30.1,26.92 v30.1,31.62
D4  (via drill 0.3)
  Top 0.178: v18.16,13.46 17.14,12.45 R4.1
  Bottom 0.178: v18.16,13.46 25.4,13.46 27.56,15.62 27.56,16.89 U$2.1
D5  (via drill 0.3)
  Top 0.178: v11.81,18.41 11.43,18.8 11.43,20.57 12.19,21.34 13.84,21.34 17.4,24.89 17.4,26.04 R5.1
  Bottom 0.178: v11.81,18.41 16.13,14.1 25.53,14.1 26.8,15.37 26.8,16.89 U$2.2
D6  (via drill 0.3)
  Top 0.178: v13.59,18.54 12.45,19.68 R6.1
  Bottom 0.178: v13.59,18.54 20.45,18.54 U$2.9
D7  (via drill 0.3)
  Top 0.178: v12.32,27.94 12.32,29.21 R7.1
  Bottom 0.178: v12.32,27.94 12.32,22.35 15.37,19.3 20.45,19.3 U$2.10
D8  (via drill 0.3)
  Top 0.178: v12.95,24.77 12.95,25.53 12.45,26.04 R8.1
  Bottom 0.178: v12.95,24.77 12.95,22.23 14.99,20.19 20.45,20.19 U$2.11
D9  (via drill 0.3)
  Top 0.178: v13.59,22.48 12.83,22.48 12.45,22.86 R9.1
  Bottom 0.178: v13.59,22.48 15.11,20.95 20.45,20.95 U$2.12
GND  (via drill 0.3)
  Top 0.178: 26.54,10.03 26.54,9.78 U$7.GND 26.54,10.03 | 26.54,10.03 26.54,11.18 26.04,11.68 26.04,13.97 C1.1 25.91,14.1 v25.91,15.37 | 26.54,10.03 28.7,12.19 U$21.P$2 28.83,12.32 28.83,13.84 30.86,15.88 33.53,15.88 33.6,15.88 | v39.62,35.94 40.89,37.21 40.89,38.1 R11.1 | U$14.A' 43.94,21.59 42.04,21.59 42.02,21.59 | v7.24,21.59 6.1,21.59 U$13.A | v25.27,27.18 28.19,30.1 28.19,33.27 25.02,36.45 25.02,41.91 BAT1.GND | X2.P$2 13.21,13.97 v15.24,16
  Bottom 0.178: v39.62,35.94 38.86,35.18 v38.86,26.29 38.23,25.65 v37.59,25.65 | 25.02,18.16 25.78,18.92 26.04,18.92 | 25.02,18.16 24.51,17.65 24.51,17.02 U$2.5 | 26.04,18.92 26.16,18.92 U$17.6 26.04,18.92 | 26.04,18.92 26.04,17.02 U$2.3 26.04,16.89 26.04,16.26 25.53,15.75 | 25.02,18.16 25.02,24.13 25.15,24.26 25.15,25.53 U$2.21 25.27,25.65 v25.27,27.18 | v7.24,21.59 9.65,21.59 v15.24,16 16.76,14.48 24.26,14.48 25.53,15.75 | 25.53,15.75 v25.91,15.37 | v35.56,14.61 v38.23,14.61
  pour Top (isolate 0.203): 33.6,26.29 42.02,26.29 42.02,14.48 33.6,14.48
MISO
  Bottom 0.178: U$2.16 20.57,24 23.24,24 23.62,23.62 U$17.1
MOSI  (via drill 0.3)
  Top 0.178: v22.1,23.37 22.1,24.26 22.61,24.77 24.77,24.77 25.02,24.51 25.02,22.73 26.42,21.34 U$17.4
  Bottom 0.178: v22.1,23.37 20.57,23.37 U$2.15
N$1
  Top 0.178: LED73.C 36.2,38.1 38.99,38.1 R11.2
N$12
  Top 0.178: IC1.1 36.83,24 36.83,20.45 C4.2 36.83,20.32 37.08,20.07 37.08,16.13 X1.1
N$13
  Top 0.178: IC1.2 38.1,24 38.1,22.86 38.99,21.97 38.99,20.45 C3.2 39.12,20.32 39.62,19.81 39.62,16.13 X1.2
N$14  (via drill 0.3)
  Top 0.178: v36.96,27.18 39.24,24.89 39.24,24.13 IC1.3 | v32.89,39.62 32.89,41.91 BAT1.PWR@1
  Bottom 0.178: v36.96,27.18 36.96,35.56 v32.89,39.62
N$15  (via drill 0.3)
  Top 0.178: v40.51,27.05 40.51,29.21 IC1.5 40.64,29.34 41.27,29.97 41.27,33.27 R15.1
  Bottom 0.178: v40.51,27.05 36.07,22.61 29.21,22.61 U$2.27
N$16  (via drill 0.3)
  Top 0.178: v30.35,21.72 30.35,23.24 33.78,26.67 35.56,26.67 36.7,27.81 38.48,27.81 39.24,28.57 39.24,29.21 IC1.6 39.24,29.34 39.24,29.97 38.23,30.99 38.23,33.27 R14.1
  Bottom 0.178: v30.35,21.72 29.21,21.72 U$2.28
RESET  (via drill 0.3)
  Top 0.178: v27.56,19.81 27.56,18.54 26.67,17.65 25.02,17.65 23.75,18.92 U$17.5 | v17.02,27.81 15.62,29.21 R12.1
  Bottom 0.178: v27.56,19.81 28.19,20.45 | 28.19,20.45 28.57,20.83 29.08,20.83 U$2.29 | v17.02,27.81 26.8,27.81 28.19,26.42 28.19,20.45
RTCPULSE  (via drill 0.3)
  Top 0.178: v32.51,30.86 34.92,33.27 R13.1 35.05,33.27 37.97,30.35 37.97,29.34 IC1.7
  Bottom 0.178: v32.51,30.86 32.51,26.16 29.72,23.37 29.21,23.37 U$2.26
SCK  (via drill 0.3)
  Top 0.178: v21.21,25.53 21.21,23.37 23.37,21.21 U$17.3
  Bottom 0.178: v21.21,25.53 21.97,25.53 U$2.17
SW-A  (via drill 0.3)
  Top 0.178: v27.56,24.26 27.56,21.97 28.19,21.34 28.19,14.48 27.18,13.46 v27.18,11.68 | v27.43,8.51 27.18,8.26 27.18,8.13 25.53,6.48 v25.53,4.83 | v26.16,0.76 v26.16,2.03 | v31.37,1.78 33.15,1.78 37.72,6.35 39.88,6.35 46.35,12.83 46.35,16.64 48.9,19.18 48.9,27.43 48.01,28.32 U$14.B
  Bottom 0.178: v27.56,24.26 26.92,24.89 26.92,25.53 U$2.23 | v27.18,11.68 27.18,8.76 v27.43,8.51 | v25.53,4.83 26.16,4.19 v26.16,2.03 | v26.16,0.76 26.67,0.76 26.8,0.64 28.45,0.64 28.7,0.89 29.84,0.89 29.97,1.02 30.61,1.02 v31.37,1.78
SW-B  (via drill 0.3)
  Top 0.178: v26.92,26.8 25.78,26.8 25.53,26.54 24,26.54 19.05,31.5 6.48,31.5 3.81,28.83 3.81,23.5 2.03,21.72 U$13.B
  Bottom 0.178: v26.92,26.8 27.56,26.16 27.56,25.65 U$2.24
VCC  (via drill 0.3)
  Top 0.178: 23.5,13.97 22.99,13.97 21.34,12.32 U$10.P$2 | 23.5,13.97 24,13.97 C1.2 | C1.2 24.13,14.1 v24.13,15.24 24.13,16.76 20.57,20.32 20.57,29.08 | 23.5,13.97 23.5,9.78 U$7.VBUS | 23.5,13.97 C1.2 | R15.2 41.27,35.31 38.23,35.31 R14.2 38.1,35.31 35.05,35.31 R13.2 | R13.2 34.92,35.31 33.91,36.32 33.91,38.1 34.04,38.1 LED73.A | IC1.8 36.7,29.21 35.18,27.69 34.67,27.69 C2.2 34.54,27.56 31.88,27.56 | 26.16,23.88 23.24,26.8 v22.86,26.8 20.57,29.08 | 26.16,23.88 26.16,23.62 U$17.2 26.16,23.88 | 20.57,29.08 20.45,29.21 17.53,29.21 R12.2 | 31.88,27.56 29.84,27.56 26.16,23.88 | 31.88,27.56 31.88,31.11 32.89,32.13 32.89,33.15 34.92,35.18 R13.2
  Bottom 0.178: 24.13,16 23.75,16.38 23.75,16.89 U$2.6 | 24.13,16 24.77,16 25.15,16.38 25.15,16.89 U$2.4 | v24.13,15.24 24.13,16 | v22.86,26.8 22.86,25.65 U$2.18
XTAL1  (via drill 0.3)
  Top 0.178: v21.46,15.11 17.27,15.11 17.14,14.99 R10.2 17.14,14.86 16.38,14.86 13.08,11.56 12.06,11.56 X2.P$1
  Bottom 0.178: v21.46,15.11 22.73,16.38 22.73,16.89 U$2.7
XTAL2  (via drill 0.3)
  Top 0.178: v18.41,16.89 17.14,16.89 R10.1 17.14,16.76 12.32,16.76 12.06,16.51 X2.P$3
  Bottom 0.178: v18.41,16.89 21.97,16.89 U$2.8

### Text on the board
tPlace: CR1216 | smallroomlabs.com/clock72a | B | A | + | -
bPlace: 12 | 1 | 11 | 2 | 10 | 3 | 9 | 4 | 8 | 5 | 7 | 6
vRestrict: 12 | 3 | 9 | 6